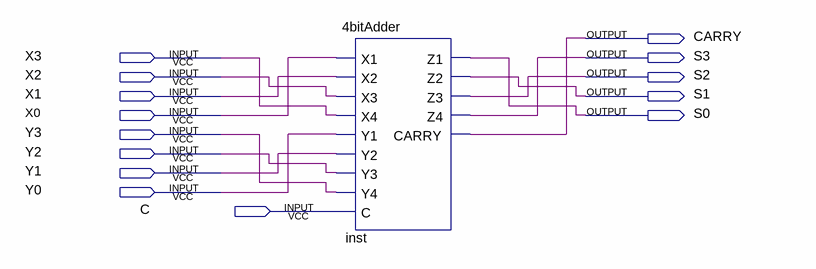
[diagram p0: schematic sheet]
// Quartus schematic 4bitAdderWrapper.bdf as structural Verilog: 1 symbols, 14 pins
module \4bitAdderWrapper  (
  input  X3,
  input  X2,
  input  X1,
  input  X0,
  input  Y3,
  input  Y2,
  input  Y1,
  input  Y0,
  input  C,
  output CARRY,
  output S3,
  output S2,
  output S1,
  output S0
);

  \4bitAdder  inst (
    .X1(X0), .X2(X1), .X3(X2), .X4(X3), .Y1(Y0), .Y2(Y1), .Y3(Y2), .Y4(Y3), .C(C), .Z1(S0), .Z2(S1), .Z3(S2),
    .Z4(S3), .CARRY(CARRY));
endmodule
